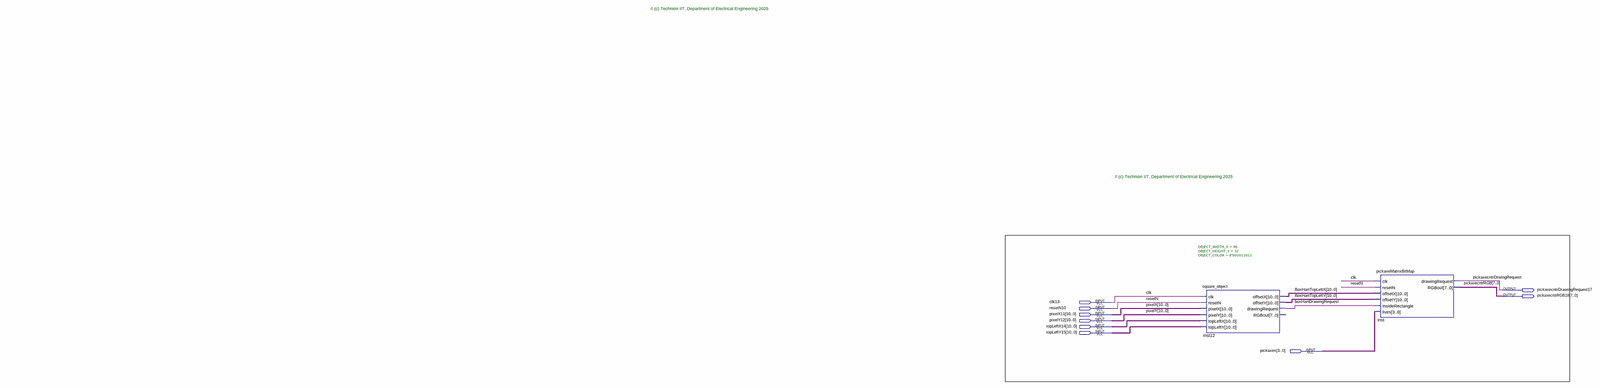
[diagram p0: schematic sheet, whole]
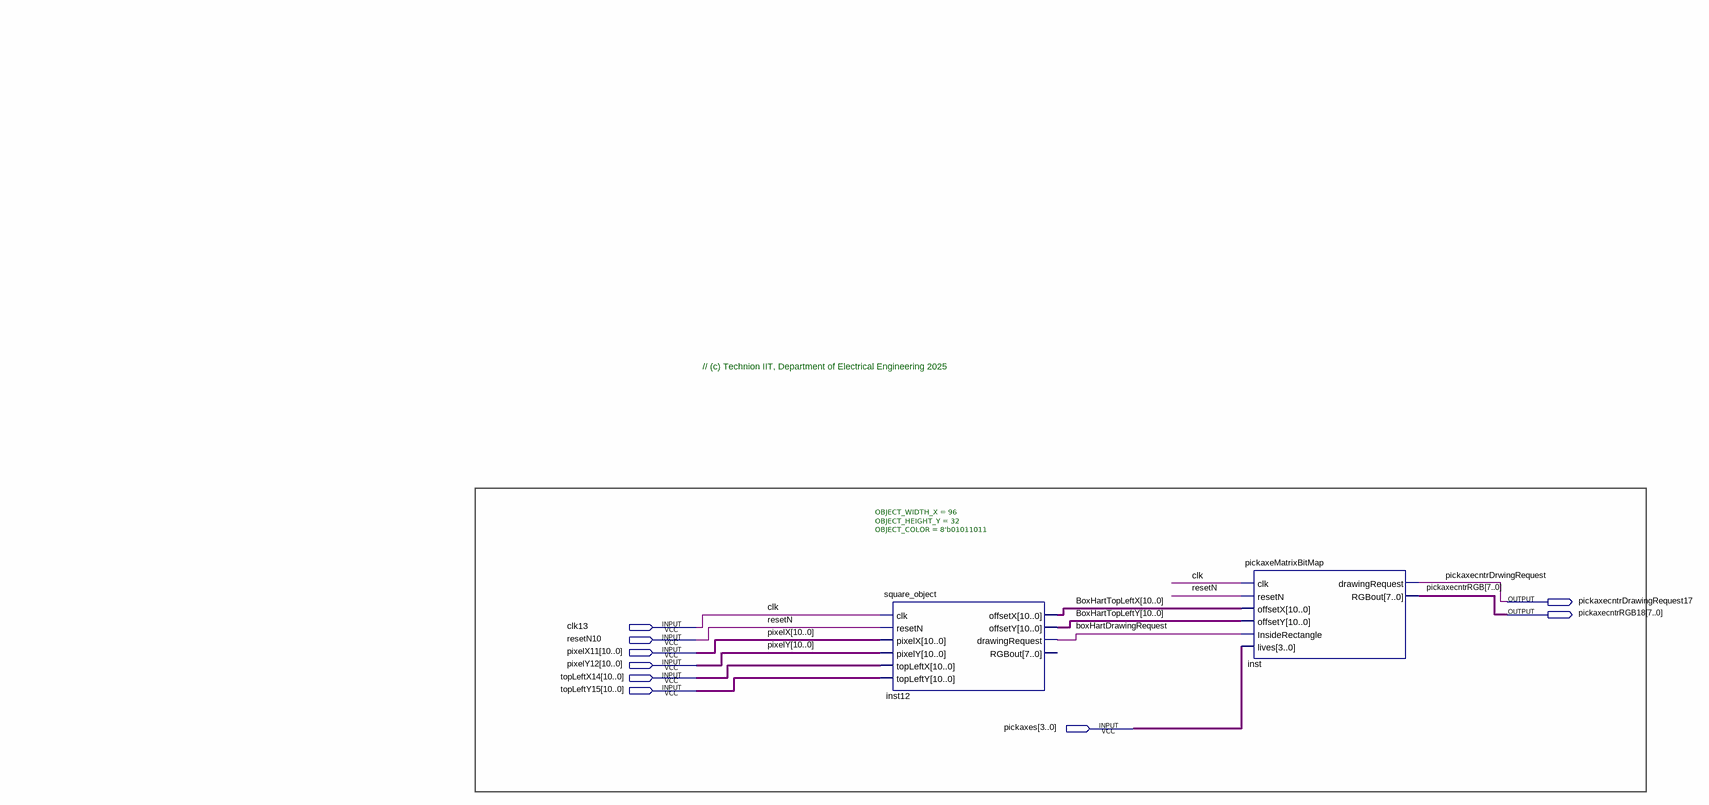
[diagram p1: schematic sheet, right part]
// Quartus schematic pickaxe_display.bdf as structural Verilog: 2 symbols, 9 pins
module pickaxe_display (
  input  clk13,
  input  resetN10,
  input  [10:0] pixelX11,
  input  [10:0] pixelY12,
  input  [10:0] topLeftX14,
  input  [10:0] topLeftY15,
  input  [3:0] pickaxes,
  output pickaxecntrDrawingRequest17,
  output [7:0] pickaxecntrRGB18
);

  wire boxHartDrawingRequest;
  wire [10:0] BoxHartTopLeftX, BoxHartTopLeftY;

  square_object #(.OBJECT_WIDTH_X(96), .OBJECT_HEIGHT_Y(32), .OBJECT_COLOR(8'b01011011)) inst12 (
    .clk(clk13), .resetN(resetN10), .pixelX(pixelX11), .pixelY(pixelY12), .topLeftX(topLeftX14),
    .topLeftY(topLeftY15), .offsetX(BoxHartTopLeftX), .offsetY(BoxHartTopLeftY),
    .drawingRequest(boxHartDrawingRequest));  // open: RGBout
  pickaxeMatrixBitMap inst (
    .clk(clk13), .resetN(resetN10), .offsetX(BoxHartTopLeftX), .offsetY(BoxHartTopLeftY),
    .InsideRectangle(boxHartDrawingRequest), .lives(pickaxes), .drawingRequest(pickaxecntrDrawingRequest17),
    .RGBout(pickaxecntrRGB18));

  // Other names for the same wires on the sheet: clk = clk13; pickaxecntrDrwingRequest = pickaxecntrDrawingRequest17;
  //   pickaxecntrRGB[7:0] = pickaxecntrRGB18; pixelX[10:0] = pixelX11; pixelY[10:0] = pixelY12; resetN = resetN10

  // Notes on the sheet:
  //   // (c) Technion IIT, Department of Electrical Engineering 2025
  //   // (c) Technion IIT, Department of Electrical Engineering 2025
endmodule
